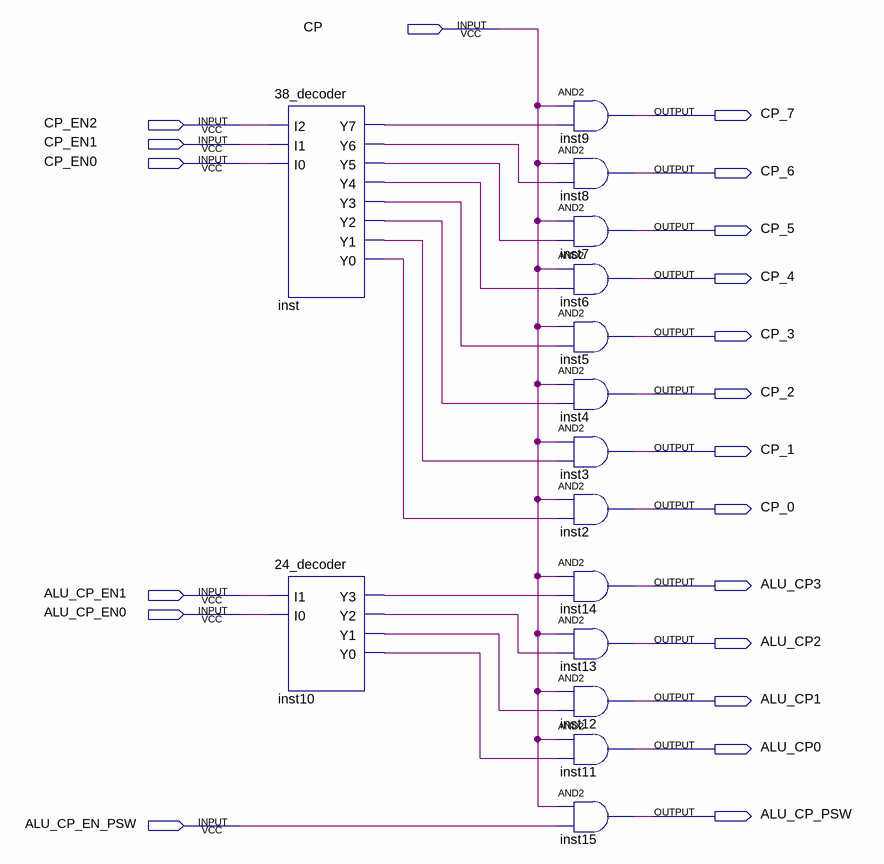
[diagram p0: schematic sheet]
// Quartus schematic cp_selector.bdf as structural Verilog: 15 symbols, 20 pins
module cp_selector (
  input  CP,
  input  CP_EN2,
  input  CP_EN1,
  input  CP_EN0,
  input  ALU_CP_EN1,
  input  ALU_CP_EN0,
  input  ALU_CP_EN_PSW,
  output CP_7,
  output CP_6,
  output CP_5,
  output CP_4,
  output CP_3,
  output CP_2,
  output CP_1,
  output CP_0,
  output ALU_CP3,
  output ALU_CP2,
  output ALU_CP1,
  output ALU_CP0,
  output ALU_CP_PSW
);

  wire inst10_y0, inst10_y1, inst10_y2, inst10_y3, inst_y0, inst_y1, inst_y2, inst_y3, inst_y4, inst_y5,
       inst_y6, inst_y7;

  \38_decoder  inst (
    .I2(CP_EN2), .I1(CP_EN1), .I0(CP_EN0), .Y7(inst_y7), .Y6(inst_y6), .Y5(inst_y5), .Y4(inst_y4),
    .Y3(inst_y3), .Y2(inst_y2), .Y1(inst_y1), .Y0(inst_y0));
  \24_decoder  inst10 (
    .I1(ALU_CP_EN1), .I0(ALU_CP_EN0), .Y3(inst10_y3), .Y2(inst10_y2), .Y1(inst10_y1), .Y0(inst10_y0));
  and inst9 (CP_7, CP, inst_y7);
  and inst8 (CP_6, CP, inst_y6);
  and inst7 (CP_5, CP, inst_y5);
  and inst6 (CP_4, CP, inst_y4);
  and inst5 (CP_3, CP, inst_y3);
  and inst4 (CP_2, CP, inst_y2);
  and inst3 (CP_1, CP, inst_y1);
  and inst2 (CP_0, CP, inst_y0);
  and inst14 (ALU_CP3, CP, inst10_y3);
  and inst13 (ALU_CP2, CP, inst10_y2);
  and inst12 (ALU_CP1, CP, inst10_y1);
  and inst11 (ALU_CP0, CP, inst10_y0);
  and inst15 (ALU_CP_PSW, CP, ALU_CP_EN_PSW);
endmodule
